# Altium schematic sheet real_time_clock.SchDoc
size A; SheetNumber: 3; SheetTotal: 12
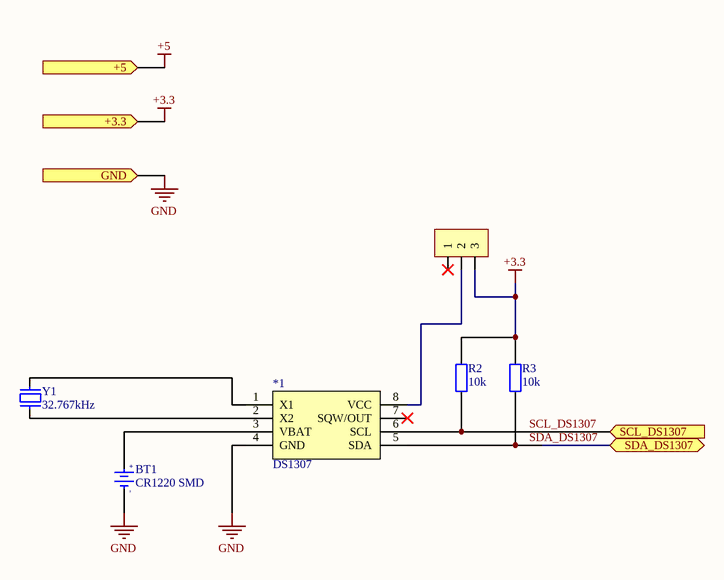
[diagram p0: real_time_clock.SchDoc]

## Parts
*1  DS1307  [SOIC 8]
BT1  CR1220 SMD  [DE PIN CR1220]
JP1  JP 1x3 2.54  [JP 1x3 DT]  (value not drawn)
R2  10k  [tro smd 0805]
R3  10k  [tro smd 0805]
Y1  32.767kHz  [Thach Anh 2 Chan 32,768 KHz]

## Ports
+3.3 (in), +5 (in), GND (in), SCL_DS1307 (in), SDA_DS1307 (bidir)

## Nets
+3.3: JP1.3 R2.2 R3.2 ; port +3.3
+5: port +5
GND: *1.4(GND) BT1.2(GND) ; port GND
SCL_DS1307: *1.6(SCL) R2.1 ; port SCL_DS1307
SDA_DS1307: *1.5(SDA) R3.1 ; port SDA_DS1307
Net*1_1: *1.1(X1) Y1.2
Net*1_2: *1.2(X2) Y1.1
Net*1_3: *1.3(VBAT) BT1.1(+3V)
Net*1_8: *1.8(VCC) JP1.2

Not connected (* = marked no-connect by the designer): *1 7(SQW/OUT)*; JP1 1*

## Notes on the sheet
- (in symbol De pin CR1220 SMD) +; -

## Library data of the parts
BT1 = De pin CR1220 SMD: Ten: Đế PIN CR1220 SMD; Ma_Hang: MH000833
JP1 = JP 1x3 2.54 Duc Thang: Cắm; Ten_Linh_Kien: Jump Đơn Đực 2.54MM 1x40P Thẳng 11MM; Don_Vi: Con; Ma_Hang: MH000903; Ghi_Chu: *; Kieu_Chan: *; Chung_Loai: Cắm
R2 R3 = Tro 0805 1% 10k: Dán; Don_Vi: Con; So_Chan: 2; Ten_Linh_Kien: Trở 0805 1% 10k; Ma_Hang: MH005473; Chung_Loai: Dán; Kieu_Chan: *
Y1 = Thach Anh 2 chan 32,768 Khz: Crystal For all Crystal 2pin.; Value: 4Mhz